# Altium schematic sheet SheetV7.2.SchDoc
size A4
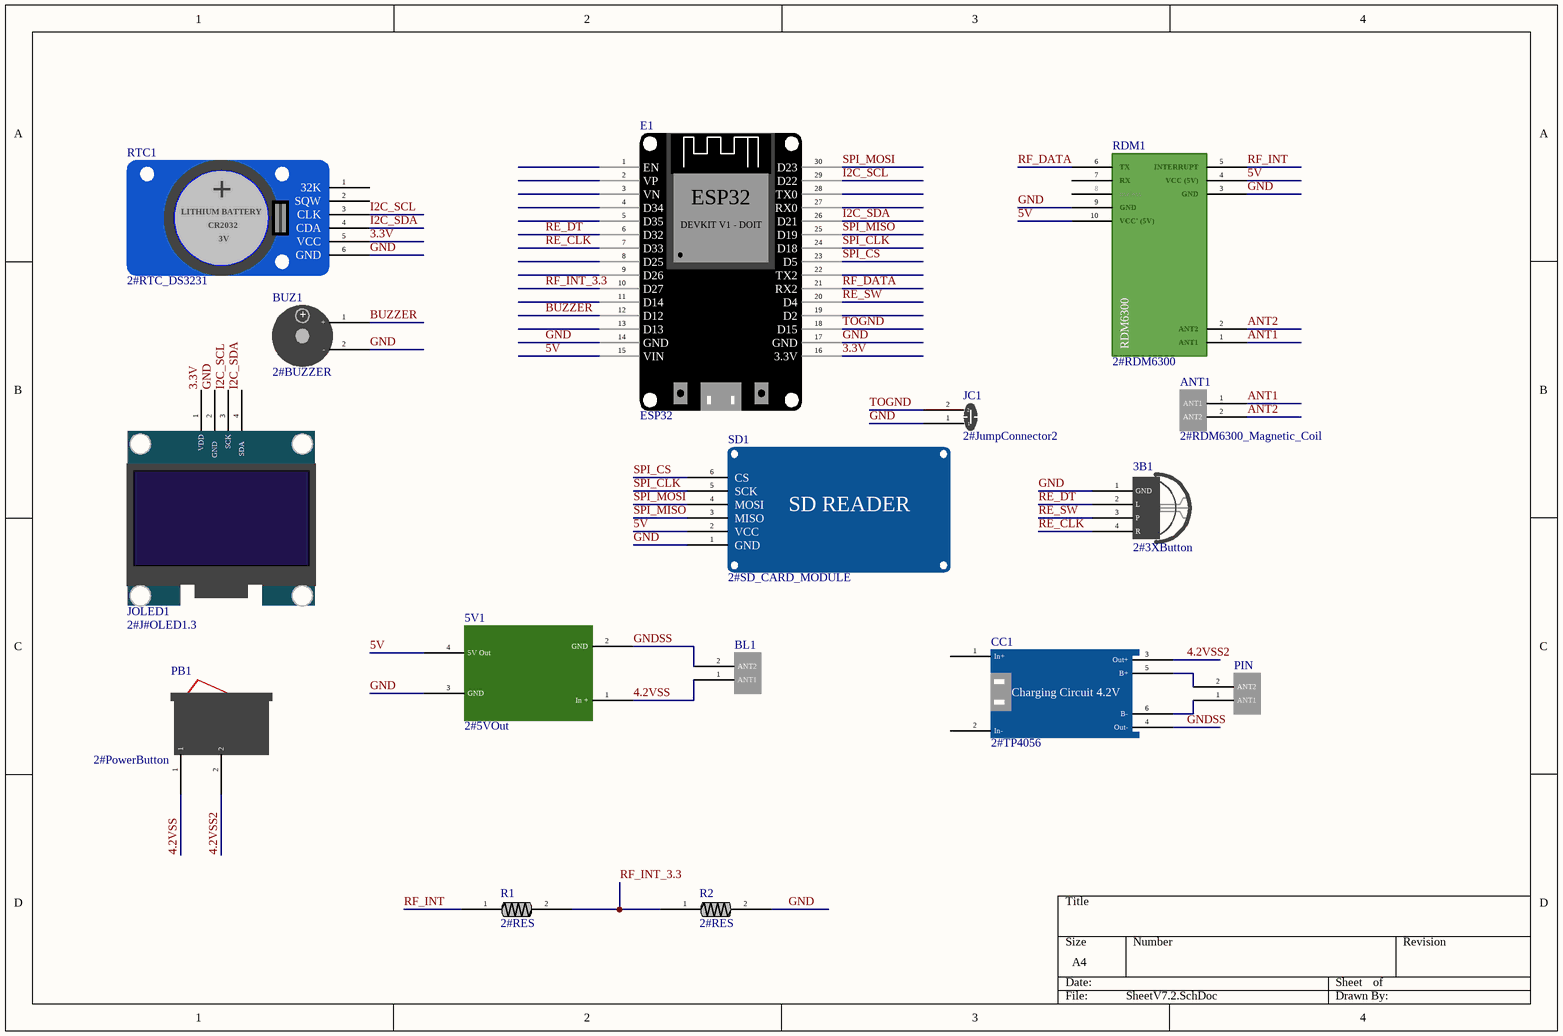
[diagram p0: SheetV7.2.SchDoc]

## Parts
3B1  2#3XButton  [2#3XButton]
5V1  2#5VOut  [2#5VOut]
ANT1  2#RDM6300_Magnetic_Coil  [2#RDM6300_Magnetic_Coil]
BL1  2#RDM6300_Magnetic_Coil  [2#RDM6300_Magnetic_Coil]  (value not drawn)
BUZ1  2#BUZZER  [2#BUZZER]
CC1  2#TP4056  [2#TP4056]
E1  ESP32  [2#1.5mmHole#ESP32]
JC1  2#JumpConnector2  [2#JumpConnector2]
JOLED1  2#J#OLED1.3  [2#Jump4#OLED_1.3]
PB1  2#PowerButton  [2#PowerButton]
PIN  2#RDM6300_Magnetic_Coil  [2#RDM6300_Magnetic_Coil]  (value not drawn)
R1  2#RES  [2#RES]
R2  2#RES  [2#RES]
RDM1  2#RDM6300  [2#RDM6300]
RTC1  2#RTC_DS3231  [2#RTC_DS3231]
SD1  2#SD_CARD_MODULE  [2#SD_READER]

## Nets
3.3V: E1.16(3.3V) JOLED1.1(VDD) RTC1.5(VCC)
4.2VSS: 5V1.1(In_+) BL1.1(ANT1) PB1.1
4.2VSS2: CC1.3(Out+) PB1.2
5V: 5V1.4(5V_Out) E1.15(VIN) RDM1.4(VCC_(5V)) RDM1.10(VCC'_(5V)) SD1.2(VCC)
ANT1: ANT1.1(ANT1) RDM1.1(ANT1)
ANT2: ANT1.2(ANT2) RDM1.2(ANT2)
BUZZER: BUZ1.1(+) E1.12(D12)
GND: 3B1.1(GND) 5V1.3(GND) BUZ1.2(-) E1.14(GND) E1.17(GND) JC1.1 JOLED1.2(GND) R2.2 RDM1.3(GND) RDM1.9(GND) RTC1.6(GND) SD1.1(GND)
GNDSS: 5V1.2(GND) BL1.2(ANT2) CC1.4(Out-)
I2C_SCL: E1.29(D22) JOLED1.3(SCK) RTC1.3(CLK)
I2C_SDA: E1.26(D21) JOLED1.4(SDA) RTC1.4(CDA)
RE_CLK: 3B1.4(R) E1.7(D33)
RE_DT: 3B1.2(L) E1.6(D32)
RE_SW: 3B1.3(P) E1.20(D4)
RF_DATA: E1.21(RX2) RDM1.6(TX)
RF_INT: R1.1 RDM1.5(INTERRUPT)
RF_INT_3.3: E1.10(D27) R1.2 R2.1
SPI_CLK: E1.24(D18) SD1.5(SCK)
SPI_CS: E1.23(D5) SD1.6(CS)
SPI_MISO: E1.25(D19) SD1.3(MISO)
SPI_MOSI: E1.30(D23) SD1.4(MOSI)
TOGND: E1.18(D15) JC1.2
NetCC1_5: CC1.5(B+) PIN.2(ANT2)
NetCC1_6: CC1.6(B-) PIN.1(ANT1)

Not connected (* = marked no-connect by the designer): CC1 1(In+) 2(In-); E1 1(EN) 2(VP) 3(VN) 4(D34) 5(D35) 8(D25) 9(D26) 11(D14) 13(D13) 19(D2) 22(TX2) 27(RX0) 28(TX0); RDM1 7(RX) 8(useless); RTC1 1(32K) 2(SQW)

## Notes on the sheet
- (in symbol 2#B#ESP32_DOIT_DEVKIT_V1) DEVKIT V1 - DOIT
- (in symbol 2#RDM6300) RDM6300
- (in symbol 2#RTC_DS3231) +; LITHIUM BATTERY; CR2032; 3V
- (in symbol 2#SD_CARD_MODULE) SD READER
- (in symbol 2#TP4056) Charging Circuit 4.2V

## Library data of the parts
E1 = 2#B#ESP32_DOIT_DEVKIT_V1